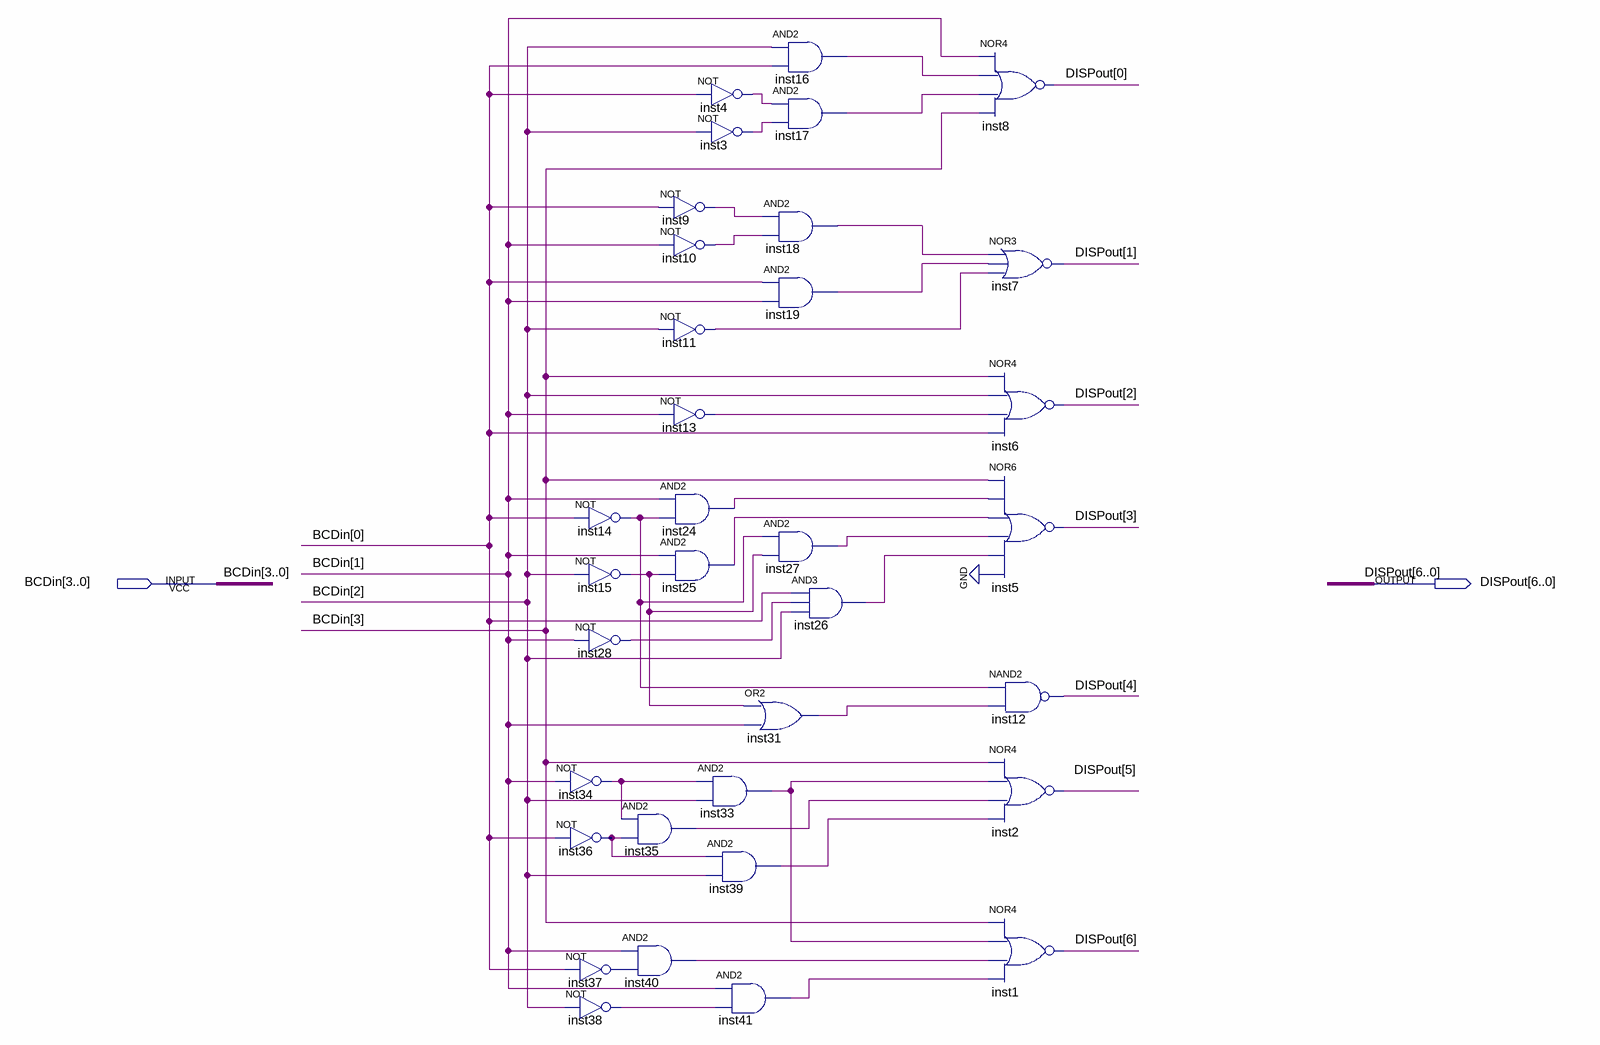
[diagram p0: schematic sheet]
// Quartus schematic bcd_to_display.bdf as structural Verilog: 34 symbols, 2 pins
module bcd_to_display (
  input  [3:0] BCDin,
  output [6:0] DISPout
);

  wire inst3_out, inst4_out, inst9_out, inst10_out, inst11_out, inst13_out, inst14_out, inst15_out,
       inst16_out, inst17_out, inst18_out, inst19_out, inst24_out, inst25_out, inst26_out, inst27_out,
       inst28_out, inst31_out, inst33_out, inst34_out, inst35_out, inst36_out, inst37_out, inst38_out,
       inst39_out, inst40_out, inst41_out;

  not inst14 (inst14_out, BCDin[0]);
  not inst15 (inst15_out, BCDin[2]);
  not inst28 (inst28_out, BCDin[1]);
  not inst34 (inst34_out, BCDin[1]);
  not inst36 (inst36_out, BCDin[0]);
  not inst37 (inst37_out, BCDin[0]);
  not inst38 (inst38_out, BCDin[2]);
  not inst9 (inst9_out, BCDin[0]);
  not inst10 (inst10_out, BCDin[1]);
  not inst11 (inst11_out, BCDin[2]);
  not inst13 (inst13_out, BCDin[1]);
  and inst24 (inst24_out, BCDin[1], inst14_out);
  and inst25 (inst25_out, BCDin[1], inst15_out);
  and inst35 (inst35_out, inst34_out, inst36_out);
  and inst40 (inst40_out, BCDin[1], inst37_out);
  not inst4 (inst4_out, BCDin[0]);
  not inst3 (inst3_out, BCDin[2]);
  and inst18 (inst18_out, inst9_out, inst10_out);
  and inst19 (inst19_out, BCDin[0], BCDin[1]);
  and inst27 (inst27_out, inst14_out, inst15_out);
  or inst31 (inst31_out, inst15_out, BCDin[1]);
  and inst33 (inst33_out, inst34_out, BCDin[2]);
  and inst39 (inst39_out, inst36_out, BCDin[2]);
  and inst41 (inst41_out, BCDin[1], inst38_out);
  and inst16 (inst16_out, BCDin[2], BCDin[0]);
  and inst17 (inst17_out, inst4_out, inst3_out);
  and inst26 (inst26_out, BCDin[0], inst28_out, BCDin[2]);
  nor inst8 (DISPout[0], BCDin[1], inst16_out, inst17_out, BCDin[3]);
  nor inst7 (DISPout[1], inst18_out, inst19_out, inst11_out);
  nor inst6 (DISPout[2], BCDin[3], BCDin[2], inst13_out, BCDin[0]);
  nor inst5 (DISPout[3], BCDin[3], inst24_out, inst25_out, inst27_out, inst26_out, 1'b0);
  nand inst12 (DISPout[4], inst14_out, inst31_out);
  nor inst2 (DISPout[5], BCDin[3], inst33_out, inst35_out, inst39_out);
  nor inst1 (DISPout[6], BCDin[3], inst33_out, inst40_out, inst41_out);
endmodule
